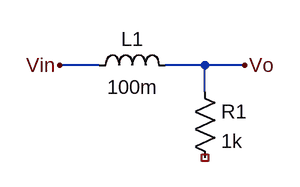
[diagram p0: schematic Fig2.asc]
Fig2.asc, the LTspice schematic file:
Version 4
SHEET 1 880 680
WIRE 80 96 32 96
WIRE 208 96 160 96
WIRE 256 96 208 96
WIRE 208 128 208 96
FLAG 256 96 Vo
FLAG 32 96 Vin
SYMBOL res 192 112 R0
SYMATTR InstName R1
SYMATTR Value 1k
SYMBOL ind 64 112 R270
WINDOW 0 32 56 VTop 2
WINDOW 3 5 56 VBottom 2
SYMATTR InstName L1
SYMATTR Value 100m

The netlist it stands for:
* Fig2.asc
R1 Vo NC_01 1k
L1 Vin Vo 100m
.backanno
.end